# Altium schematic sheet RTD.SchDoc
size A4
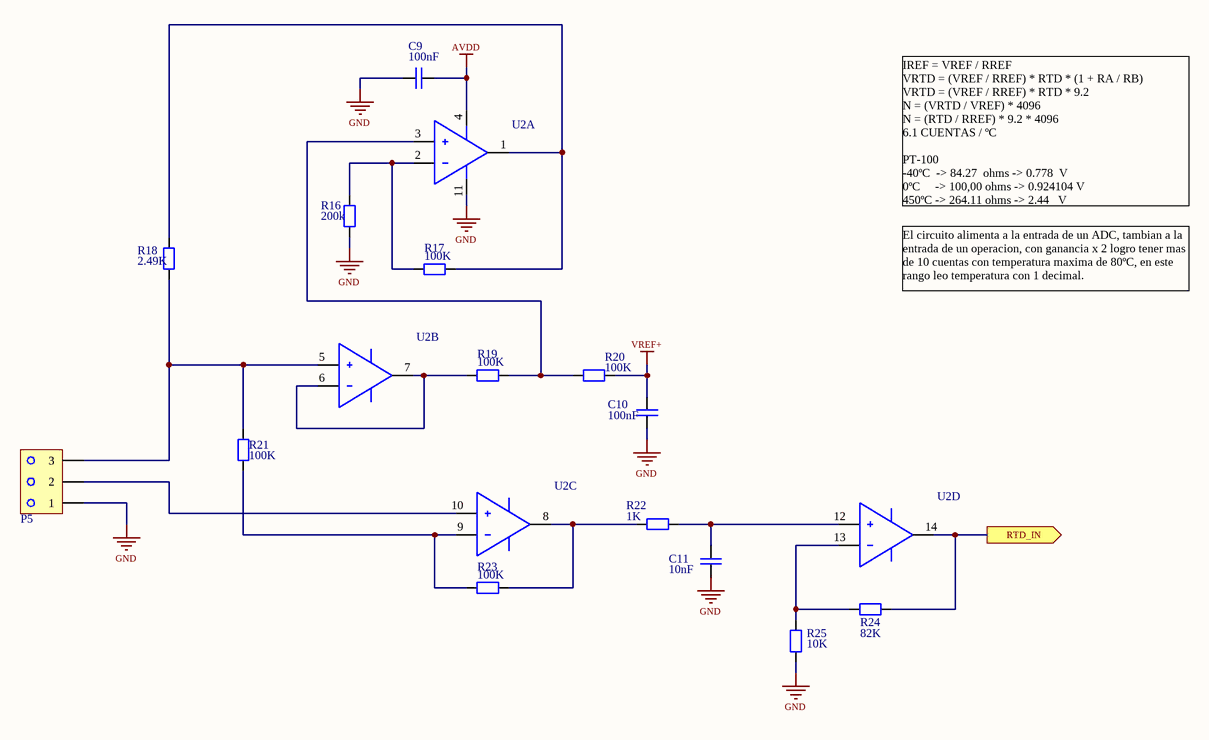
[diagram p0: RTD.SchDoc]

## Parts
C9  100nF  [CAP_SM0805_YAGEOCC2_N]
C10  100nF  [CAP_SM0805_YAGEOCC2_N]
C11  10nF  [CAP_SM0805_YAGEOCC2_N]
P5  WJ15EDGVC-3.81-3P  [HEADER PLUG 3]  (value not drawn)
R16  200k  [RES_SM0805_YAGEORC_N]
R17  100K  [RES_SM0805_YAGEORC_N]
R18  2.49K  [RES_SM0805_YAGEORC_N]
R19  100K  [RES_SM0805_YAGEORC_N]
R20  100K  [RES_SM0805_YAGEORC_N]
R21  100K  [RES_SM0805_YAGEORC_N]
R22  1K  [RES_SM0805_YAGEORC_N]
R23  100K  [RES_SM0805_YAGEORC_N]
R24  82K  [RES_SM0805_YAGEORC_N]
R25  10K  [RES_SM0805_YAGEORC_N]
U2  GS8044  [GS8044-SR]  (value not drawn)  (parts A,B,C,D of 4)

## Ports
RTD_IN (out)

## Nets
AVDD: C9.1 U2.4(VDD)
GND: C9.2 C10.2 C11.2 P5.1 R16.1 R25.1 U2.11(VSS)
VREF+: C10.1 R20.2
RTD_IN: R24.2 U2.14(VOUTD) ; port RTD_IN
NetC11_1: C11.1 R22.2 U2.12(VIND+)
NetP5_2: P5.2 U2.10(VINC+)
NetP5_3: P5.3 R18.1 R21.2 U2.5(VINB+)
NetR16_2: R16.2 R17.1 U2.2(VINA-)
NetR17_2: R17.2 R18.2 U2.1(VOUTA)
NetR19_1: R19.1 U2.6(VINB-) U2.7(VOUTB)
NetR19_2: R19.2 R20.1 U2.3(VINA+)
NetR21_1: R21.1 R23.1 U2.9(VINC-)
NetR22_1: R22.1 R23.2 U2.8(VOUTC)
NetR24_1: R24.1 R25.2 U2.13(VIND-)

## Notes on the sheet
- IREF = VREF / RREF
  VRTD = (VREF / RREF) * RTD * (1 + RA / RB)
  VRTD = (VREF / RREF) * RTD * 9.2
  N = (VRTD / VREF) * 4096
  N = (RTD / RREF) * 9.2 * 4096
  6.1 CUENTAS / ºC
  PT-100
  -40ºC  -> 84.27  ohms -> 0.778  V
  0ºC     -> 100,00 ohms -> 0.924104 V
  450ºC -> 264.11 ohms -> 2.44   V
- El circuito alimenta a la entrada de un ADC, tambian a la entrada de un operacion, con ganancia x 2 logro tener mas de 10 cuentas con temperatura maxima de 80ºC, en este rango leo temperatura con 1 decimal.
- Title:
- Size: A4
- Date:
- FMC-320U MODEL A
- Sheet:
- Time:
- Of:
- Version:
- Revision:
- Release:
- 1
- 0
- FLOWMEET SRL
- File

## Library data of the parts
C9 C10 = CC0805KRX7R8BB104: CAP 100nF SM0805 X7R 25V YAGEO CC2; Tolerance (%): 10; Voltage Rating (Volts): 25; Category: Capacitor; Manufacturer: Yageo; Manufacturer Part Number: CC0805KRX7R8BB104; Package: 0805; Value: 100nF; Supplier Part Number 1: 644249; Supplier 1: Farnell; ComponentLink1URL: http://www.yageo.com; ComponentLink1Description: Manufacturer Website; Supplier 2: Digi-Key; Supplier Part Number 2: 311-1141-1-ND
C11 = CC0805KRX7R8BB103: CAP 10nF SM0805 X7R 25V YAGEO CC2; Tolerance (%): 10; Voltage Rating (Volts): 25; Category: Capacitor; Manufacturer: Yageo; Manufacturer Part Number: CC0805KRX7R8BB103; Package: 0805; Value: 10nF; Supplier Part Number 1: 3019767; Supplier 1: Farnell; ComponentLink1URL: http://www.yageo.com; ComponentLink1Description: Manufacturer Website
P5 = WJ15EDGVC-3.81-3P: TERM BLOK FEMALE 1X3 3.81MM; Manufacturer: Ningbo Kangnex Elec; Manufacturer Part Number: WJ15EDGVC-3.81-3P; Category: Bornera enchufable; Datasheet: https://datasheet.lcsc.com/lcsc/1912251632_Ningbo-Kangnex-Elec-WJ15EDGVC-3-81-3P_C8389.pdf
R16 = RC0805FR-07200KL: RES 200K SM0805 YAGEO RC_L; Power (Watts): 0.1; Resistance (Ohms): 200000; Tolerance (%): 1; Category: Resistor; Manufacturer: Yageo; Manufacturer Part Number: RC0805FR-07200KL; Package: 0805; Value: 200k; ComponentLink1URL: http://www.yageo.com; ComponentLink1Description: Manufacturer Website
R17 R19-R21 R23 = RC0805FR-07100KL: RES 100K SM0805 YAGEO RC_L; Power (Watts): 0.125; Resistance (Ohms): 100000; Tolerance (%): 1; Category: Resistor; Manufacturer: Yageo; Manufacturer Part Number: RC0805FR-07100KL; Package: 0805; Value: 100K; Supplier Part Number 1: 9237879; Supplier 1: Farnell; ComponentLink1Description: Manufacturer Website; ComponentLink1URL: http://www.yageo.com; Supplier 2: Digi-Key; Supplier Part Number 2: 311-100KCRCT-ND
R18 = RT0805FRE072K49L: RES 2K49 SM0805 YAGEO RT_L; Manufacturer Part Number: RC0603FR-072K49L; Power (Watts): 0.1; Resistance (Ohms): 2490; Tolerance (%): 1; Category: Resistor; Manufacturer: Yageo; Package: 0805; Value: 2.49K; ComponentLink1URL: http://www.yageo.com; ComponentLink1Description: Manufacturer Website
R22 = RC0805FR-071KL: RES 1K SM0805 YAGEO RC_L; Power (Watts): 0.125; Resistance (Ohms): 1000; Tolerance (%): 1; Category: Resistor; Manufacturer: Yageo; Manufacturer Part Number: RC0805FR-071KL; Package: 0805; Value: 1K; Supplier Part Number 1: 9237496; Supplier 1: Farnell; ComponentLink1URL: http://www.yageo.com; ComponentLink1Description: Manufacturer Website; Supplier 2: Digi-Key; Supplier Part Number 2: 311-1.00KCRCT-ND
R24 = RC0805FR-0782KL: RES 82K SM0805 YAGEO RC_L; Power (Watts): 0.125; Resistance (Ohms): 82000; Tolerance (%): 1; Category: Resistor; Manufacturer: Yageo; Manufacturer Part Number: RC0805FR-0782KL; Package: 0805; Value: 82K; Supplier Part Number 1: 9237860; Supplier 1: Farnell; ComponentLink1Description: Manufacturer Website; ComponentLink1URL: http://www.yageo.com; Supplier 2: Digi-Key; Supplier Part Number 2: 311-82.0KCRCT-ND
R25 = RC0805FR-0710KL: RES 10K SM0805 YAGEO RC_L; Power (Watts): 0.125; Resistance (Ohms): 10000; Tolerance (%): 1; Category: Resistor; Manufacturer: Yageo; Manufacturer Part Number: RC0805FR-0710KL; Package: 0805; Value: 10K; Supplier Part Number 1: 9237755; Supplier 1: Farnell; ComponentLink1Description: Manufacturer Website; ComponentLink1URL: http://www.yageo.com; Supplier 2: Digi-Key; Supplier Part Number 2: 311-10.0KCRCT-ND
U2 = GS8044-SR: IC OPAMP GP 4 CIRCUIT 14SOIC; Manufacturer: Gainsil; Manufacturer Part Number: GS8044-SR; Category: Amplificador operacional; Datasheet: https://datasheet.lcsc.com/lcsc/2206101816_Gainsil-GS8044-SR_C605428.pdf